# EAGLE design ESP8266_daughter_board (EAGLE 7.4.0)
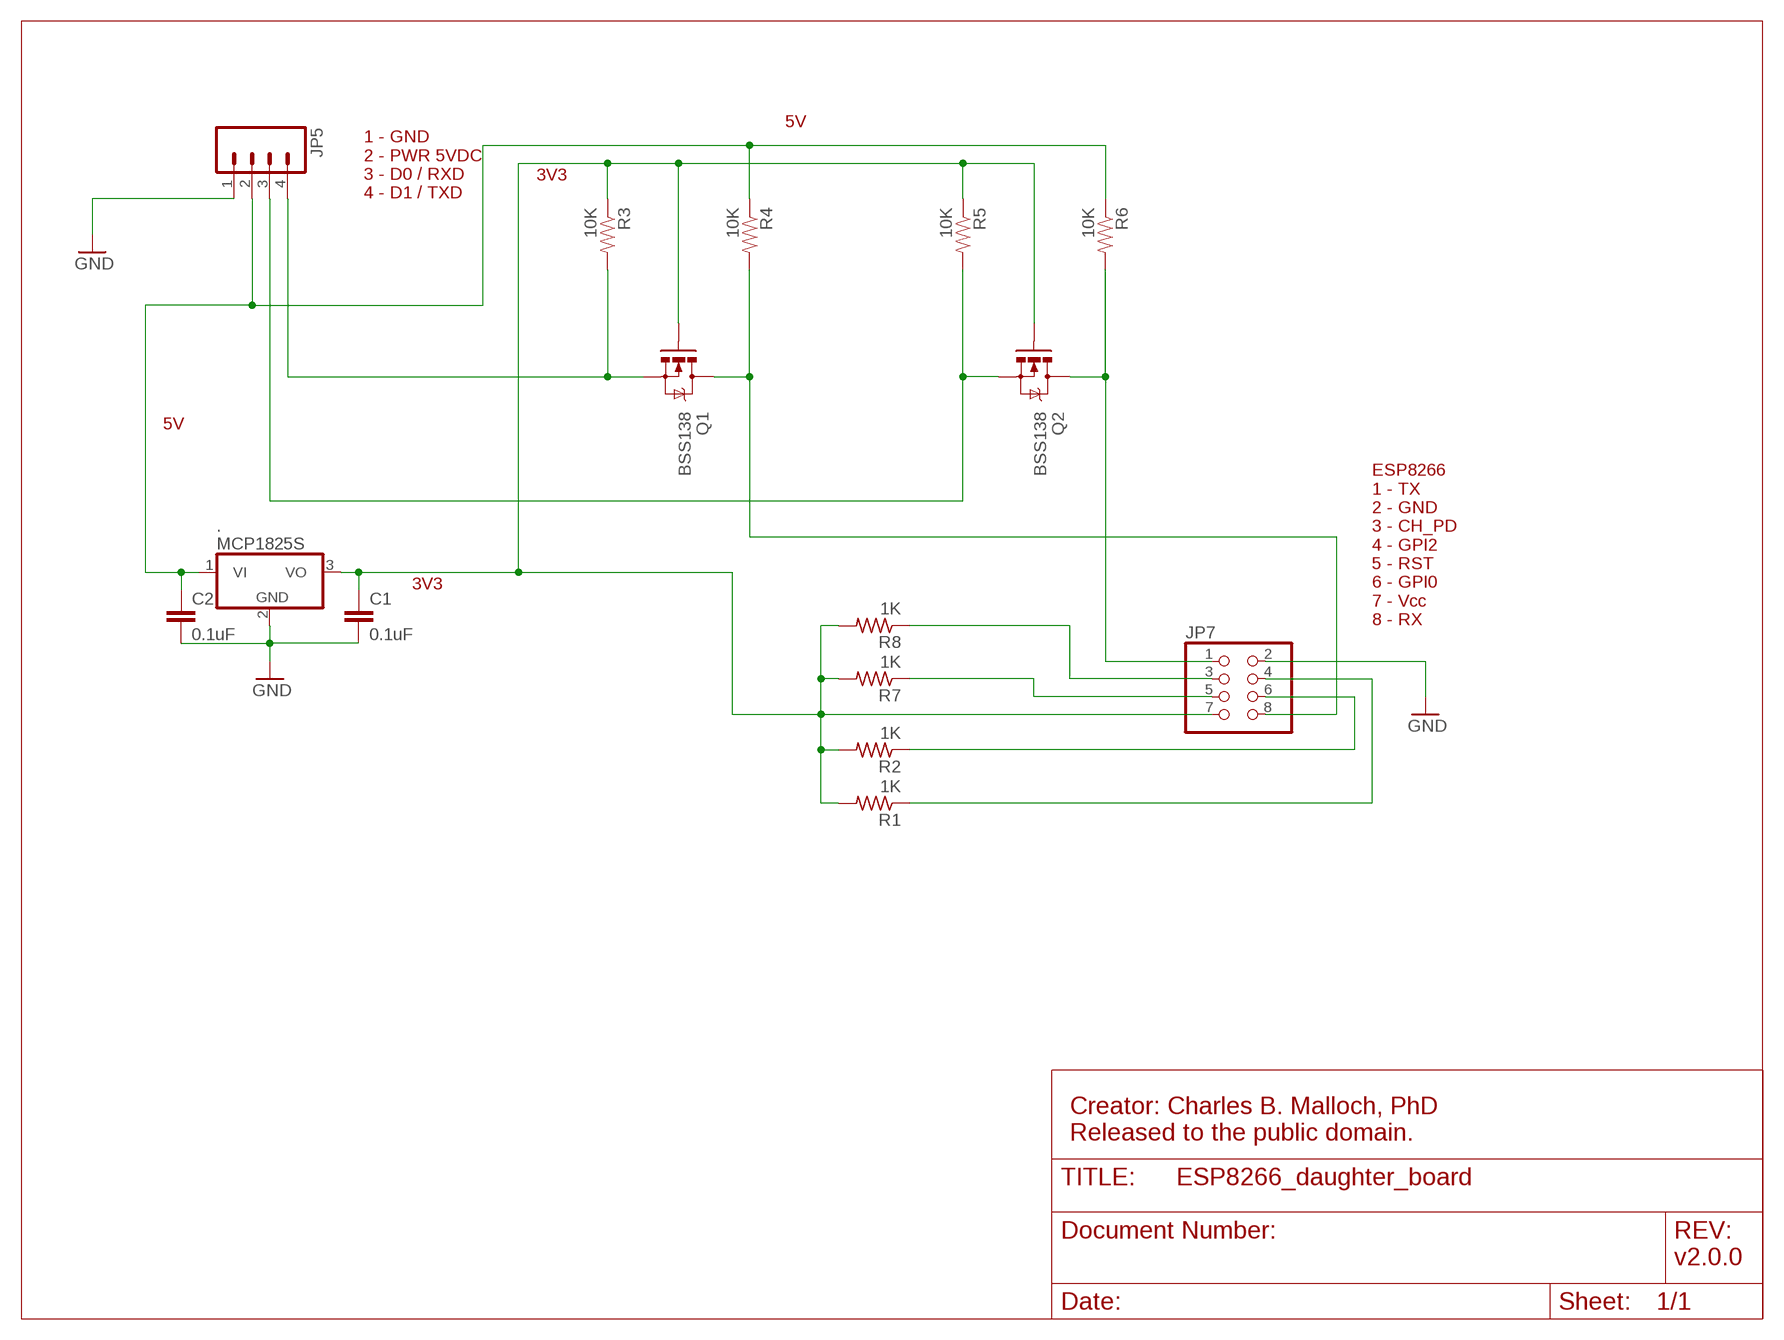
[diagram p0: schematic, sheet 1]

## Parts
.  MCP1825S  MCP1703DB  [SOT223]
C1  0.1uF  CAPEZ  [CAP-PTH-SMALLEZ]
C2  0.1uF  CAPEZ  [CAP-PTH-SMALLEZ]
JP5  M04LOCK_LONGPADS  [1X04_LOCK_LONGPADS]
JP7  PINHD-2X4  [2X04]
Q1  BSS138  BSS138TRANS-00830  [SOT23-3]
Q2  BSS138  BSS138TRANS-00830  [SOT23-3]
R1  1K  R-US_0204/7  [0204/7]
R2  1K  R-US_0204/7  [0204/7]
R3  10K  RESISTOR1206  [1206]
R4  10K  RESISTOR1206  [1206]
R5  10K  RESISTOR1206  [1206]
R6  10K  RESISTOR1206  [1206]
R7  1K  R-US_0204/7  [0204/7]
R8  1K  R-US_0204/7  [0204/7]

## Nets
3V3 [POWER]: ..3(VO) C1.1 JP7.7 Q1.1(G) Q2.1(G) R1.2 R2.2 R3.1 R5.1 R7.2 R8.2
5V [POWER]: ..1(VI) C2.1 JP5.2 R4.1 R6.1
GND [POWER]: ..2(GND) C1.2 C2.2 JP5.1 JP7.2
N$3: JP5.4 Q1.2(S) R3.2
N$5: JP5.3 Q2.2(S) R5.2
N$7: JP7.8 Q1.3(D) R4.2
N$9: JP7.1 Q2.3(D) R6.2
N$13: JP7.3 R8.1
N$21: JP7.5 R7.1
N$22: JP7.6 R2.1
N$24: JP7.4 R1.1

## Notes on the sheet
- 5V
- 3V3
- 1 - GND
   2 - PWR 5VDC
   3 - D0 / RXD
   4 - D1 / TXD
- 5V
- 3V3
- ESP8266
  1 - TX
  2 - GND
  3 - CH_PD
  4 - GPI2
  5 - RST
  6 - GPI0
  7 - Vcc
  8 - RX
- Creator: Charles B. Malloch, PhD
  Released to the public domain.
- v2.0.0

## Library data of the parts
. = linear:MCP1703: 250 mA, 16V, Low Quiescent Current LDO Regulator Source: http://ww1.microchip.com/downloads/en/DeviceDoc/22049b.pdf
C1 C2 = SparkFun-Capacitors:CAP: Capacitor Standard 0603 ceramic capacitor, and 0.1" leaded capacitor.
JP5 = SparkFun-Connectors:M04: Header 4 Standard 4-pin 0.1" header. Use with straight break away headers (SKU : PRT-00116), right angle break away headers (PRT-00553), swiss pins (PRT-00743), machine pins (PRT-00117), and female headers (PRT-00115). Molex polarized connector foot print use with SKU : PRT-08231 with associated crimp pins and housings. 1MM SMD Version SKU: PRT-10208
JP7 = pinhead:PINHD-2X4: PIN HEADER
Q1 Q2 = SparkFun-DiscreteSemi:BSS138: NMOSFET, Enh Mode 50V/6-ohm 200mA (SOT-23) TRANS-00830; PROD_ID: TRANS-00830
R1 R2 R7 R8 = resistor:R-US_: RESISTOR, American symbol
R3-R6 = SparkFun-Passives:RESISTOR: Resistor Basic schematic elements and footprints for 0603, 1206, and PTH resistors.

## Net classes
1 POWER: width 0.61 mm, clearance 0.305 mm

## Board
Arduino specialized to drive 3-color LED / LED strip
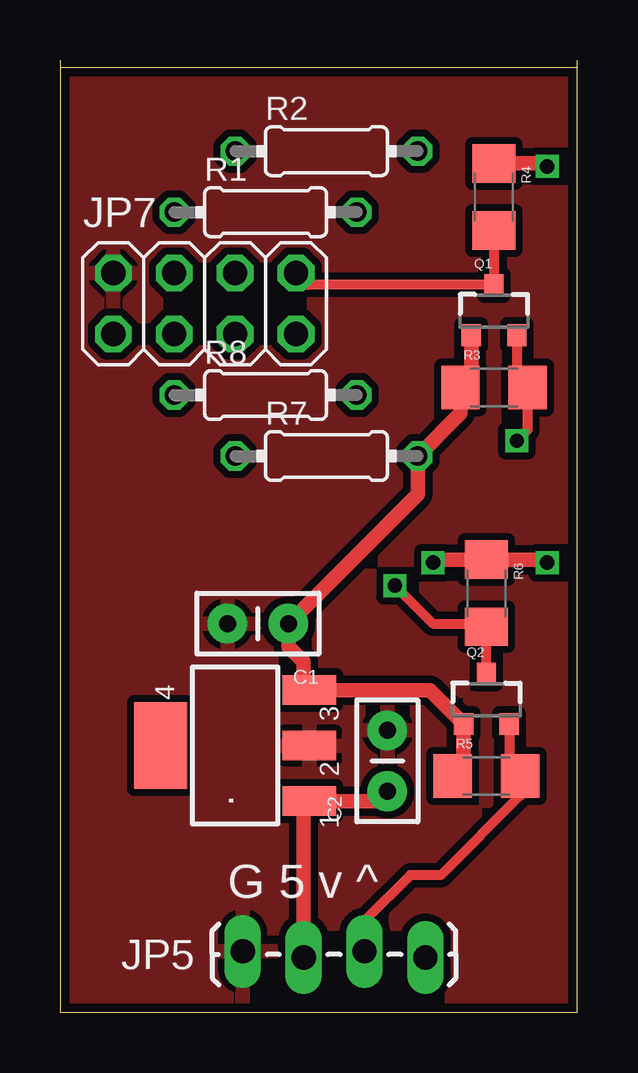
[diagram p1: board, top side]
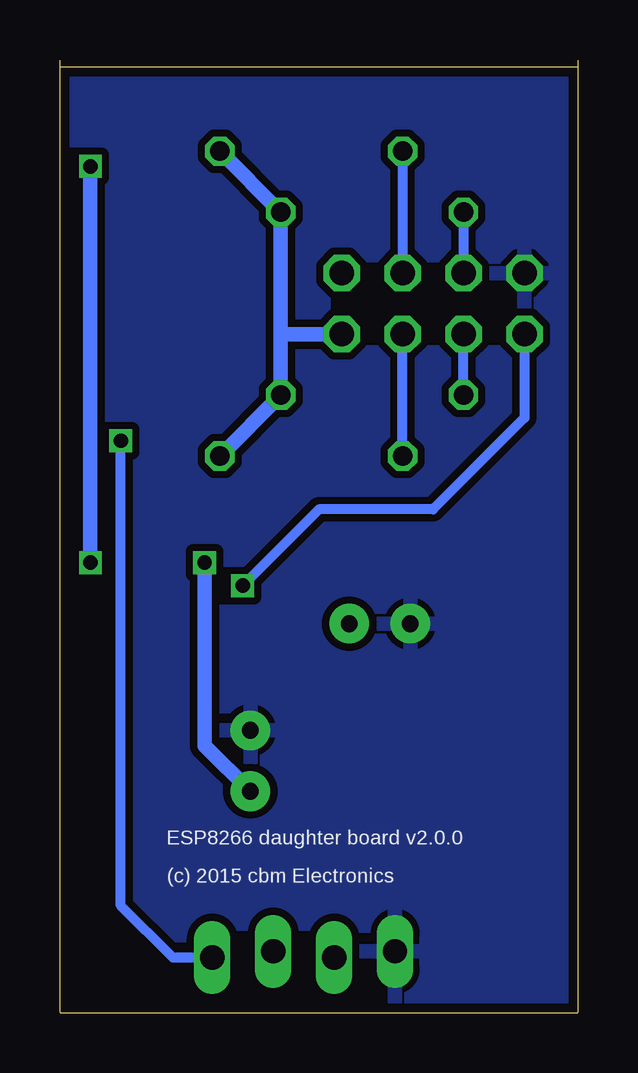
[diagram p2: board, bottom side, seen from below]

Size 21.59 x 39.69 mm. Coordinates in mm from the lower left corner, seen from the top.
Outline: 21.58,0.01 21.58,39.69
Outline: 0,39.69 0,39.38
Outline: 0,39.38 0,0.01
Outline: 21.58,0 0,0
Outline: 0,39.38 21.59,39.38
Copper layers (1*16): Top 0.0356mm / dielectric 1.5011mm / Bottom 0.0356mm
Design rules "LaenPCBOrder": minimum track width 6mil, minimum drill 13mil, track to track 6mil, track to pad 6mil, pad to pad 6mil, via to via 6mil, smd to smd 6mil, copper to edge 15mil, drill to drill 6mil, minimum pad ring 7mil, minimum via ring 7mil, stop-mask expansion 4mil, vias tented up to drill 0mil, thermal gap 10mil

### Footprints (pad centres in the part's own frame; a part is rotated, then mirrored left to right if it is on the bottom)
SOT223 = smd 1.219 x 2.235: 1 -2.311,-3.099; 2 0,-3.099; 3 2.311,-3.099 | smd 3.6 x 2.2: 4 0,3.099
CAP-PTH-SMALLEZ = drill 0.7 pad 1.651: 1 0,0; 2 2.54,0
1X04_LOCK_LONGPADS = drill 1.016 long: 1 0,0; 2 2.54,-0.254; 3 5.08,0; 4 7.62,-0.254
2X04 = drill 1.016 octagon: 1 -3.81,-1.27; 2 -3.81,1.27; 3 -1.27,-1.27; 4 -1.27,1.27; 5 1.27,-1.27; 6 1.27,1.27; 7 3.81,-1.27; 8 3.81,1.27
SOT23-3 = smd 0.8 x 0.9: 1 -0.95,-1; 2 0.95,-1; 3 0,1.1
0204/7 = drill 0.813 octagon: 1 -3.81,0; 2 3.81,0
1206 = smd 1.6 x 1.8: 1 -1.4,0; 2 1.4,0

### Placement (x,y rotation side)
.  7.3,11.12 90 top
C1  9.53,16.2 180 top
C2  13.65,9.22 90 top
JP5  7.62,2.55 0 top
JP7  6.03,29.54 0 top
Q1  18.1,29.22 0 top
Q2  17.78,13.03 0 top
R1  8.57,33.35 0 top
R2  11.11,35.89 0 top
R3  18.1,26.05 0 top
R4  18.1,33.98 270 top
R5  17.78,9.85 0 top
R6  17.78,17.47 270 top
R7  11.11,23.19 0 top
R8  8.57,25.73 0 top

### Tracks (layer width: path | path; a pad name or v marks a point on that pad's centre or on a via)
3V3
  Top 0.61: Q1.1 17.15,26.5 R3.1 16.7,24.96 R7.2 14.92,21.6 C1.1 9.53,15.25 10.16,14.62 10.16,13.67 ..3 15.42,13.43 Q2.1 16.83,10.3 R5.1
  Bottom 0.61: R7.2 R8.2 12.38,28.27 | 12.38,28.27 R1.2 R2.2 | JP7.7 12.38,28.27
5V  (via drill 0.6)
  Top 0.61: R4.1 20.19,35.38 v20.32,35.25 | v20.32,18.74 20.19,18.87 R6.1 15.69,18.87 v15.56,18.74 | JP5.2 10.16,8.57 ..1 13.25,8.81 C2.1
  Bottom 0.61: v20.32,35.25 v20.32,18.74 | v15.56,18.74 15.56,11.12 C2.1
GND
  pour Top: 0,39.38 0,0.01 21.59,0.01 21.59,39.38
  pour Bottom: 0,39.38 21.59,39.38 21.59,0.01 0,0.01
N$3  (via drill 0.6)
  Top 0.406: Q1.2 19.05,26.5 R3.2 19.5,24.27 v19.05,23.82
  Bottom 0.406: v19.05,23.82 19.05,4.46 16.89,2.3 JP5.4
N$5
  Top 0.406: Q2.2 18.73,10.3 R5.2 19.18,9.03 15.88,5.72 14.61,5.72 12.7,3.82 JP5.3
N$7
  Top 0.406: R4.2 Q1.3 10.33,30.32 JP7.8
N$9  (via drill 0.6)
  Top 0.406: Q2.3 R6.2 17.65,16.2 15.56,16.2 v13.97,17.79
  Bottom 0.406: JP7.1 2.22,24.78 6.03,20.96 10.79,20.96 v13.97,17.79
N$13
  Bottom 0.406: R8.1 JP7.3
N$21
  Bottom 0.406: R7.1 JP7.5
N$22
  Bottom 0.406: R2.1 JP7.6
N$24
  Bottom 0.406: R1.1 JP7.4

### Text on the board
tNames: G 5 v ^
bNames: ESP8266 daughter board v2.0.0 | (c) 2015 cbm Electronics